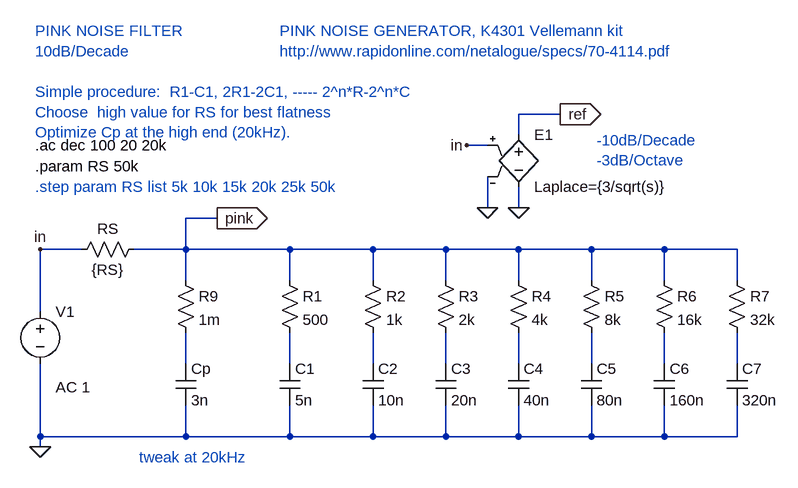
[diagram p0: schematic pink_noise_filter1.asc]
pink_noise_filter1.asc, the LTspice schematic file:
Version 4
SHEET 1 1248 680
WIRE 688 -112 624 -112
WIRE 624 -80 624 -112
WIRE 576 -64 544 -64
WIRE 576 32 576 -16
WIRE 624 32 624 0
WIRE 160 48 112 48
WIRE -48 96 -112 96
WIRE 112 96 112 48
WIRE 112 96 32 96
WIRE 272 96 112 96
WIRE 400 96 272 96
WIRE 512 96 400 96
WIRE 624 96 512 96
WIRE 736 96 624 96
WIRE 848 96 736 96
WIRE 960 96 848 96
WIRE 112 144 112 96
WIRE 272 144 272 96
WIRE 400 144 400 96
WIRE 512 144 512 96
WIRE 624 144 624 96
WIRE 736 144 736 96
WIRE 848 144 848 96
WIRE 960 144 960 96
WIRE -112 192 -112 96
WIRE 112 272 112 224
WIRE 272 272 272 224
WIRE 400 272 400 224
WIRE 512 272 512 224
WIRE 624 272 624 224
WIRE 736 272 736 224
WIRE 848 272 848 224
WIRE 960 272 960 224
WIRE -112 384 -112 272
WIRE 112 384 112 336
WIRE 112 384 -112 384
WIRE 272 384 272 336
WIRE 272 384 112 384
WIRE 400 384 400 336
WIRE 400 384 272 384
WIRE 512 384 512 336
WIRE 512 384 400 384
WIRE 624 384 624 336
WIRE 624 384 512 384
WIRE 736 384 736 336
WIRE 736 384 624 384
WIRE 848 384 848 336
WIRE 848 384 736 384
WIRE 960 384 960 336
WIRE 960 384 848 384
WIRE -112 400 -112 384
FLAG -112 400 0
FLAG 160 48 pink
IOPIN 160 48 Out
FLAG -112 96 in
FLAG 688 -112 ref
IOPIN 688 -112 Out
FLAG 624 32 0
FLAG 576 32 0
FLAG 544 -64 in
SYMBOL res 384 128 R0
SYMATTR InstName R2
SYMATTR Value 1k
SYMBOL res 496 128 R0
SYMATTR InstName R3
SYMATTR Value 2k
SYMBOL res 608 128 R0
SYMATTR InstName R4
SYMATTR Value 4k
SYMBOL cap 384 272 R0
SYMATTR InstName C2
SYMATTR Value 10n
SYMBOL cap 496 272 R0
SYMATTR InstName C3
SYMATTR Value 20n
SYMBOL cap 608 272 R0
SYMATTR InstName C4
SYMATTR Value 40n
SYMBOL res -64 112 R270
WINDOW 0 32 56 VTop 0
WINDOW 3 0 56 VBottom 0
SYMATTR InstName RS
SYMATTR Value {RS}
SYMBOL cap 256 272 R0
SYMATTR InstName C1
SYMATTR Value 5n
SYMBOL res 720 128 R0
SYMATTR InstName R5
SYMATTR Value 8k
SYMBOL cap 720 272 R0
SYMATTR InstName C5
SYMATTR Value 80n
SYMBOL res 832 128 R0
SYMATTR InstName R6
SYMATTR Value 16k
SYMBOL cap 832 272 R0
SYMATTR InstName C6
SYMATTR Value 160n
SYMBOL res 944 128 R0
SYMATTR InstName R7
SYMATTR Value 32k
SYMBOL cap 944 272 R0
SYMATTR InstName C7
SYMATTR Value 320n
SYMBOL voltage -112 176 R0
WINDOW 123 24 132 Left 0
WINDOW 39 0 0 Left 0
SYMATTR InstName V1
SYMATTR Value ""
SYMATTR Value2 AC 1
SYMBOL res 256 128 R0
SYMATTR InstName R1
SYMATTR Value 500
SYMBOL cap 96 272 R0
SYMATTR InstName Cp
SYMATTR Value 3n
SYMBOL res 96 128 R0
SYMATTR InstName R9
SYMATTR Value 1m
SYMBOL e 624 -96 R0
SYMATTR InstName E1
SYMATTR Value Laplace={3/sqrt(s)}
TEXT -120 -64 Left 0 !.ac dec 100 20 20k
TEXT -120 0 Left 0 ;.step param RS list 5k 10k 15k 20k 25k 50k
TEXT -120 -32 Left 0 !.param RS 50k
TEXT -120 -240 Left 0 ;PINK NOISE FILTER\n10dB/Decade\n \nSimple procedure:  R1-C1, 2R1-2C1, ----- 2^n*R-2^n*C\nChoose  high value for RS for best flatness\nOptimize Cp at the high end (20kHz).
TEXT 40 416 Left 0 ;tweak at 20kHz
TEXT 256 -240 Left 0 ;PINK NOISE GENERATOR, K4301 Vellemann kit\nhttp://www.rapidonline.com/netalogue/specs/70-4114.pdf
TEXT 744 -72 Left 0 ;-10dB/Decade\n-3dB/Octave

The netlist it stands for:
* pink_noise_filter1.asc
R2 pink N003 1k
R3 pink N004 2k
R4 pink N005 4k
C2 N003 0 10n
C3 N004 0 20n
C4 N005 0 40n
RS in pink {RS}
C1 N002 0 5n
R5 pink N006 8k
C5 N006 0 80n
R6 pink N007 16k
C6 N007 0 160n
R7 pink N008 32k
C7 N008 0 320n
V1 in 0 AC 1
R1 pink N002 500
Cp N001 0 3n
R9 pink N001 1m
E1 ref 0 in 0 Laplace={3/sqrt(s)}
.ac dec 100 20 20k
* .step param RS list 5k 10k 15k 20k 25k 50k
.param RS 50k
* PINK NOISE FILTER
* 10dB/Decade
* Simple procedure:  R1-C1, 2R1-2C1, ----- 2^n*R-2^n*C
* Choose  high value for RS for best flatness
* Optimize Cp at the high end (20kHz).
* tweak at 20kHz
* PINK NOISE GENERATOR, K4301 Vellemann kit
* http://www.rapidonline.com/netalogue/specs/70-4114.pdf
* -10dB/Decade
* -3dB/Octave
.backanno
.end